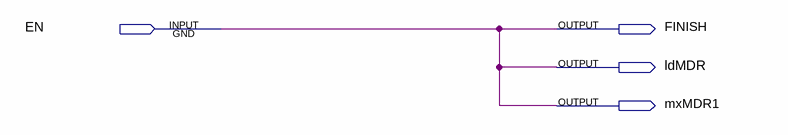
[diagram p0: schematic sheet]
// Quartus schematic acc.bdf as structural Verilog: 0 symbols, 4 pins
module acc (
  input  EN,
  output FINISH,
  output ldMDR,
  output mxMDR1
);


  assign FINISH = EN;
  assign ldMDR = EN;
  assign mxMDR1 = EN;
endmodule
